# EAGLE design Module (EAGLE 9.4.2)
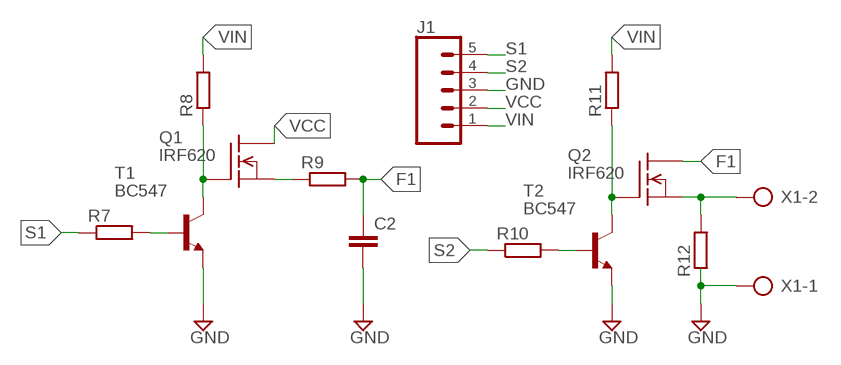
[diagram p0: schematic, sheet 1]

## Parts
C2  C5/5  [C5B5]
J1  CONN_05  [1X05]
Q1  IRF620  [TO220]
Q2  IRF620  [TO220]
R7  R-EU_0309/12  [0309/12]
R8  R-EU_0309/12  [0309/12]
R9  R-EU_0309/12  [0309/12]
R10  R-EU_0309/12  [0309/12]
R11  R-EU_0309/12  [0309/12]
R12  R-EU_0309/12  [0309/12]
T1  BC547  [TO92]
T2  BC547  [TO92]
X1  AK500/2-H  [AK500/2-H]

## Nets
F1: C2.1 Q2.2(D) R9.2
GND: C2.2 J1.3 R12.1 T1.1(E) T2.1(E) X1.1
N$1: Q1.1(G) R8.1 T1.3(C)
N$2: Q2.1(G) R11.1 T2.3(C)
N$3: R7.2 T1.2(B)
N$4: R10.2 T2.2(B)
N$5: Q1.3(S) R9.1
N$6: Q2.3(S) R12.2 X1.2
S1: J1.5 R7.1
S2: J1.4 R10.1
VCC: J1.2 Q1.2(D)
VIN: J1.1 R8.2 R11.2

## Library data of the parts
C2 = capacitor-wima:C: CAPACITOR naming: grid - package width
J1 = SparkFun-Connectors:CONN_05: Multi connection point. Often used as Generic Header-pin footprint for 0.1 inch spaced/style header connections On any of the 0.1 inch spaced packages, you can populate with these: Break Away Headers - Straight <https://www.sparkfun.com/products/116> (PRT-00116) Break Away Male Headers - Right Angle <https://www.sparkfun.com/products/553> (PRT-00553) Female Headers <https://www.sparkfun.com/products/115> (PRT-00115) Break Away Headers - Machine Pin <https://www.sparkfun.com/products/117> (PRT-00117) Break Away Female Headers - Swiss Machine Pin <https://www.sparkfun.com/products/743> (PRT-00743) For SCREWTERMINALS and SPRING TERMINALS visit here: Screw Terimnals on SparkFun.com <https://www.sparkfun.com/search/results?term=Screw+Terminals> (5mm/3.5mm/2.54mm spacing) This device is also useful as a general connection point to wire up your design to another part of your project. Our various solder wires solder well into these plated through hole pads. Hook-Up Wire - Assortment (Stranded, 22 AWG) <https://www.sparkfun.com/products/11375> (PRT-11375) Hook-Up Wire - Assortment (Solid Core, 22 AWG) <https://www.sparkfun.com/products/11367> (PRT-11367) View the entire wire category on our website here <https://www.sparkfun.com/categories/141> Special notes: Molex polarized connector foot print use with SKU : PRT-08231 with associated crimp pins and housings. 1MM SMD Version SKU: PRT-10208
Q1 Q2 = transistor-fet:IRF620: N-Channel Enhancement MOSFET (HEXFET); 200V; 5,2A; 0,8Ohm
R7-R12 = rcl:R-EU_: RESISTOR, European symbol; SPICEPREFIX: R
T1 T2 = transistor:BC547: NPN TRANSISTOR
X1 = con-ptr500:AK500/2-H: CONNECTOR Aug. 2004 / PTR Meßtechnik: Die Bezeichnung der Serie AK505 wurde geändert. Es handelt sich hierbei um AK500 in horizontaler Ausführung.; OC_FARNELL: unknown; OC_NEWARK: unknown

## Board
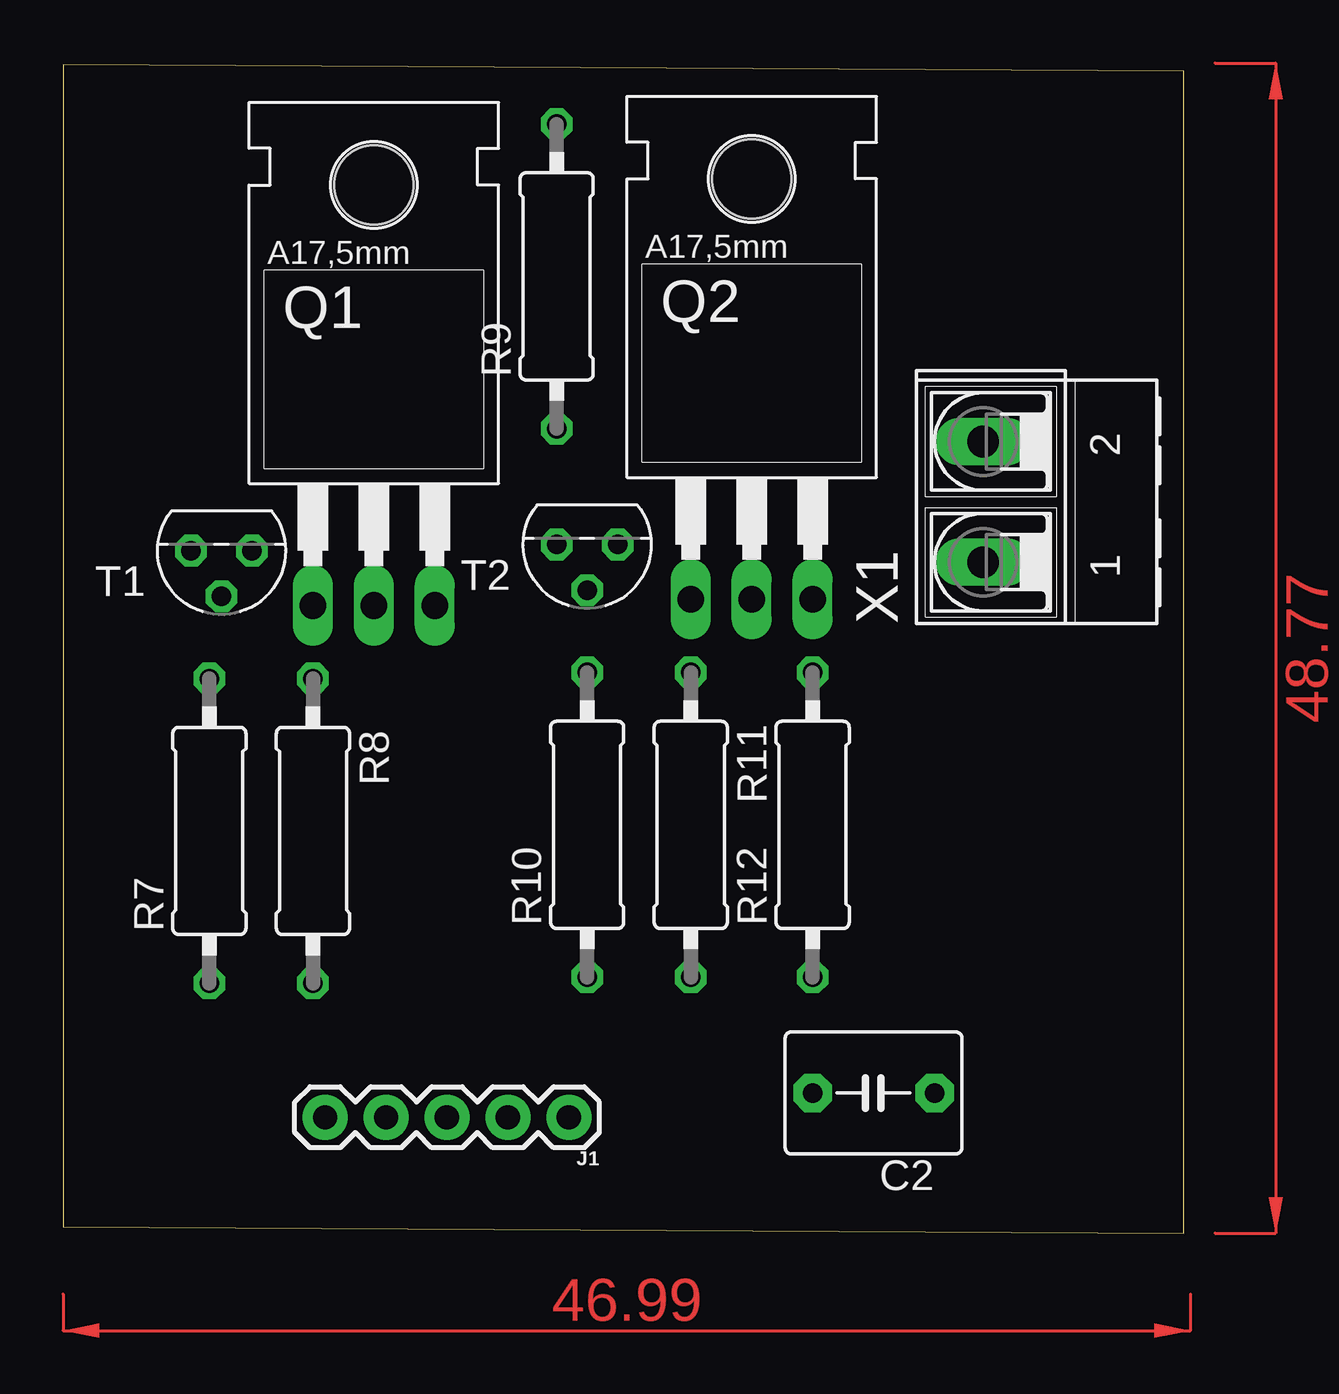
[diagram p1: board, top side]
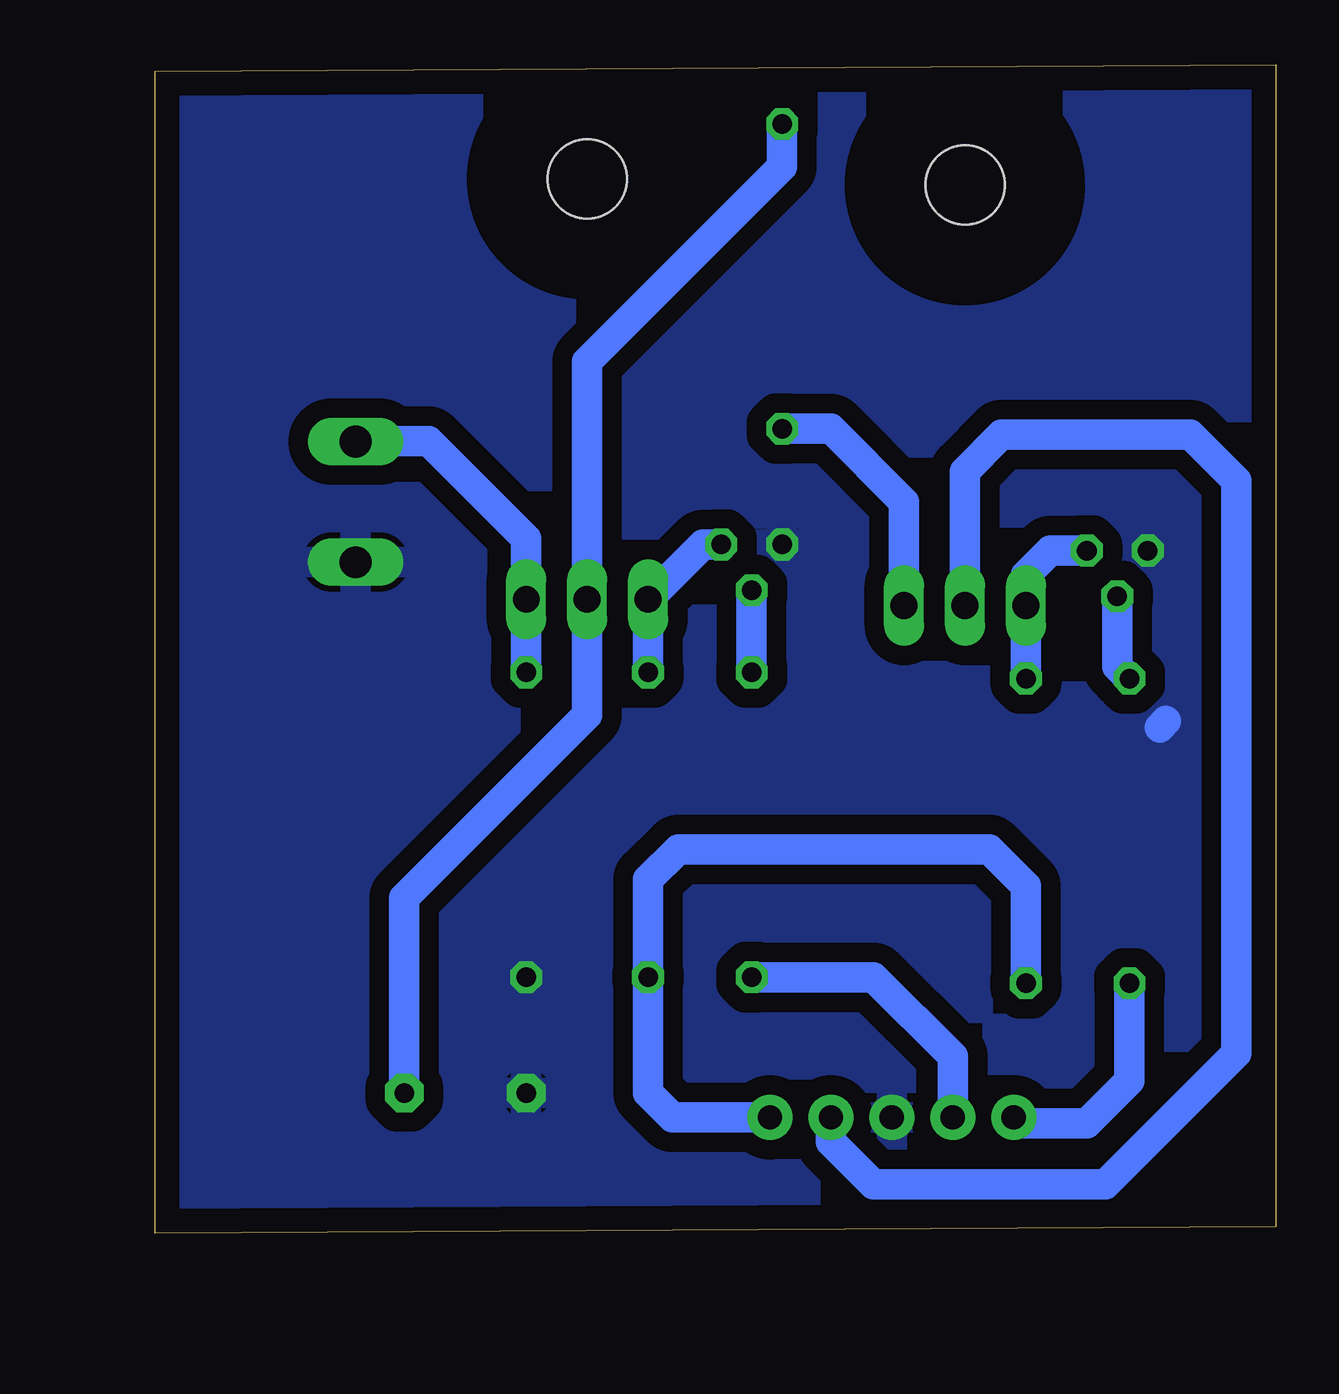
[diagram p2: board, bottom side, seen from below]

Size 46.72 x 48.69 mm. Coordinates in mm from the lower left corner, seen from the top.
Outline: 0,0.25 46.72,0 46.72,48.44 0,48.69 0,0.25
Copper layers (1*16): Top 0.035mm / dielectric 1.5mm / Bottom 0.035mm
Design rules "default": minimum track width 6mil, minimum drill 0.35mm, track to track 6mil, track to pad 6mil, pad to pad 6mil, via to via 6mil, smd to smd 6mil, copper to edge 40mil, drill to drill 6mil, minimum pad ring 10mil, minimum via ring 8mil, stop-mask expansion 4mil, vias tented up to drill 0mil, thermal gap 10mil

### Footprints (pad centres in the part's own frame; a part is rotated, then mirrored left to right if it is on the bottom)
C5B5 = drill 0.813 pad 1.6 octagon: 1 -2.54,0; 2 2.54,0
1X05 = drill 1.016 pad 1.88: 1 0,0; 2 2.54,0; 3 5.08,0; 4 7.62,0; 5 10.16,0
TO220 = drill 1.118 long: 1 -2.54,-6.35; 2 0,-6.35; 3 2.54,-6.35 | hole 3.302: 0,11.176
0309/12 = drill 0.813 octagon: 1 -6.35,0; 2 6.35,0
TO92 = drill 0.813 octagon: 1 1.27,0; 2 0,1.905; 3 -1.27,0
AK500/2-H = drill 1.321 long: 1 -2.515,0; 2 2.515,0

### Placement (x,y rotation side)
C2  33.78,5.84 180 top
J1  21.08,4.83 180 top
Q1  12.95,32.51 0 top
Q2  28.7,32.77 0 top
R7  6.1,16.76 90 top
R8  10.41,16.76 270 top
R9  20.57,39.88 90 top
R10  21.84,17.02 90 top
R11  26.16,17.02 270 top
R12  31.24,17.02 90 top
T1  6.6,28.45 180 top
T2  21.84,28.7 180 top
X1  38.35,30.48 90 top

### Tracks (layer width: path | path; a pad name or v marks a point on that pad's centre or on a via)
F1
  Bottom 1.27: R9.2 20.57,44.45 28.7,36.32 Q2.2 28.7,21.59 36.32,13.97 C2.1
GND
  Bottom 1.27: 4.57,21.34 4.83,21.08
  pour Bottom (isolate 0.813): 0,48.51 46.74,48.51 46.74,0.25 0,0.25
N$1
  Bottom 1.27: R8.1 Q1.1 10.41,27.43 9.4,28.45 T1.3
N$2
  Bottom 1.27: R11.1 Q2.1 23.88,28.7 T2.3
N$3
  Bottom 1.27: R7.2 6.6,23.62 T1.2
N$4
  Bottom 1.27: R10.2 T2.2
N$5
  Bottom 1.27: Q1.3 15.49,30.48 18.54,33.53 R9.1
N$6
  Bottom 1.27: R12.2 Q2.3 31.24,28.96 35.31,33.02 38.33,33.02 X1.2
S1
  Bottom 1.27: R7.1 6.1,6.35 7.87,4.57 10.67,4.57 J1.5
S2
  Bottom 1.27: J1.4 13.46,7.37 16.76,10.67 R10.1
VCC
  Bottom 1.27: Q1.2 12.95,31.75 11.43,33.27 3.56,33.27 1.65,31.37 1.65,7.49 7.11,2.03 16.76,2.03 18.54,3.81 J1.2
VIN
  Bottom 1.27: R8.2 10.41,14.48 11.94,16 24.89,16 26.16,14.73 R11.2 26.16,5.84 25.15,4.83 J1.1
(copper drawn outside any net)
  shapes: Top area x2